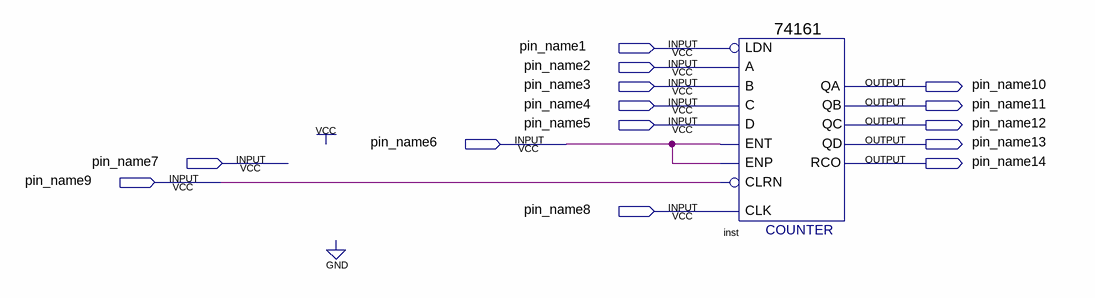
[diagram p0: schematic sheet]
// Quartus schematic exp2.bdf as structural Verilog: 1 symbols, 14 pins
module exp2 (
  input  pin_name1,
  input  pin_name2,
  input  pin_name3,
  input  pin_name4,
  input  pin_name5,
  input  pin_name6,
  input  pin_name7,
  input  pin_name9,
  input  pin_name8,
  output pin_name10,
  output pin_name11,
  output pin_name12,
  output pin_name13,
  output pin_name14
);

  \74161  inst (
    .CLRN(pin_name9), .CLK(pin_name8), .ENP(pin_name6), .LDN(pin_name1), .A(pin_name2), .D(pin_name5),
    .ENT(pin_name6), .B(pin_name3), .C(pin_name4), .QD(pin_name13), .QC(pin_name12), .QB(pin_name11),
    .QA(pin_name10), .RCO(pin_name14));
endmodule
